# Altium schematic sheet Cover.SchDoc
size A4
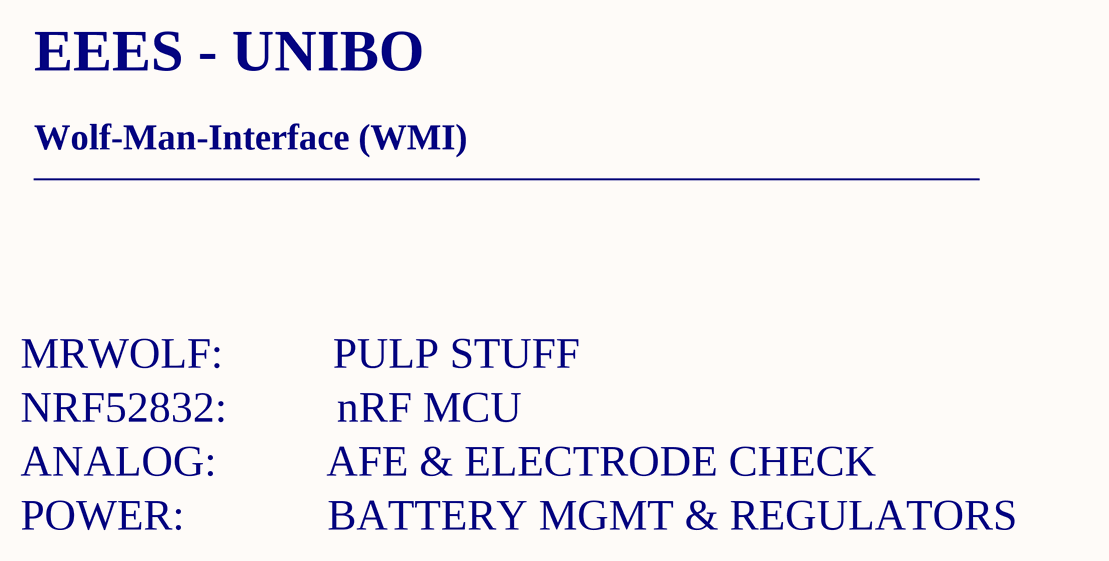
[diagram p0: Cover.SchDoc]

## Notes on the sheet
- EEES - UNIBO
- Wolf-Man-Interface (WMI)
- ___________________________________________
- MRWOLF:          PULP STUFF
- NRF52832:          nRF MCU
- ANALOG:          AFE & ELECTRODE CHECK
- POWER:             BATTERY MGMT & REGULATORS